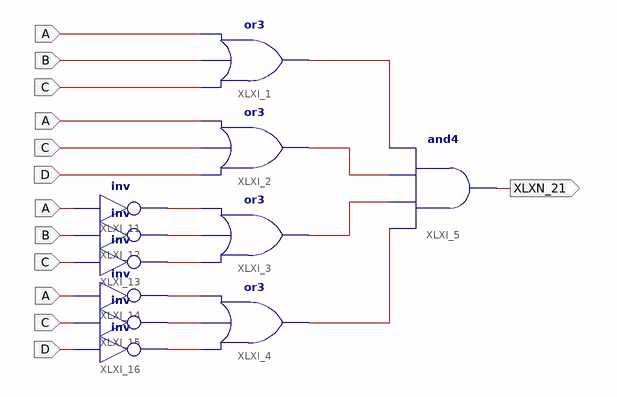
[diagram p0: schematic sheet 1]
// Xilinx ISE schematic problem2.sch (spartan3e) as structural Verilog: 11 symbols, 5 ports
module problem2 (
  input  A,
  input  B,
  input  C,
  input  D,
  output XLXN_21
);

  wire XLXN_1, XLXN_2, XLXN_3, XLXN_4, XLXN_15, XLXN_16, XLXN_17, XLXN_18, XLXN_19, XLXN_20;

  or XLXI_2 (XLXN_2, D, C, A);
  or XLXI_3 (XLXN_3, XLXN_17, XLXN_16, XLXN_15);
  or XLXI_4 (XLXN_4, XLXN_20, XLXN_19, XLXN_18);
  or XLXI_1 (XLXN_1, C, B, A);
  and XLXI_5 (XLXN_21, XLXN_4, XLXN_3, XLXN_2, XLXN_1);
  not XLXI_12 (XLXN_16, B);
  not XLXI_13 (XLXN_17, C);
  not XLXI_14 (XLXN_18, A);
  not XLXI_15 (XLXN_19, C);
  not XLXI_16 (XLXN_20, D);
  not XLXI_11 (XLXN_15, A);
endmodule
